# Altium project Phare.PrjPCB
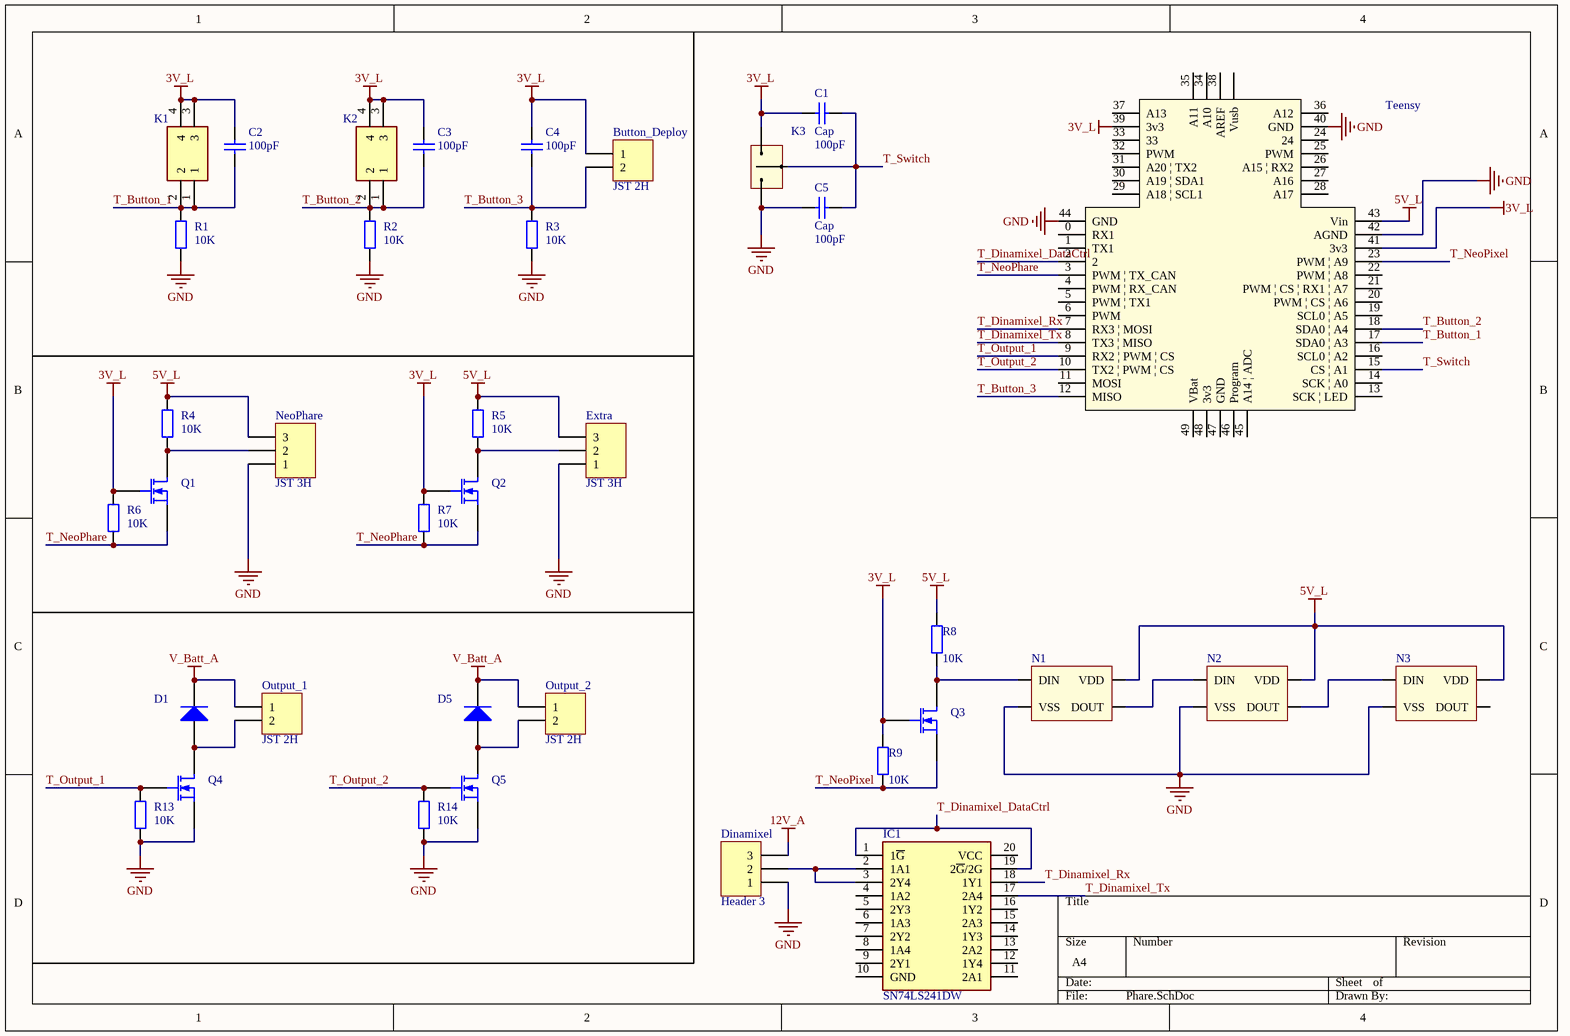
[diagram p0: Phare.SchDoc]
2 sheets, 58 parts. Net scope: global (net labels, ports and power ports of the same name join across sheets).
Board file: Phare.PcbDoc
Sheets:
  Phare.SchDoc
  Phare_Alim.SchDoc

## Sheet Phare.SchDoc
size A4

### Parts
Button_Deploy  JST 2H  [S2B-XH-A]
C1  Cap  value 100pF  [Capacitor 1206]
C2  value 100pF  [Capacitor 1206]  (hidden comment: Cap)
C3  value 100pF  [Capacitor 1206]  (hidden comment: Cap)
C4  value 100pF  [Capacitor 1206]  (hidden comment: Cap)
C5  Cap  value 100pF  [Capacitor 1206]
D1  Diode  [SMC]  (value not drawn)
D5  Diode  [SMC]  (value not drawn)
Dinamixel  Header 3  [Molex SPOX 3x1H]
Extra  JST 3H  [S3B-XH-A]
IC1  SN74LS241DW  [SOIC127P1030X265-20N]
K1  4-1437565-1  [FSM-SWITCH]  (value not drawn)
K2  4-1437565-1  [FSM-SWITCH]  (value not drawn)
K3  Switch  [SWITCH]  (value not drawn)
N1  NeoPixel  [Neopixel]  (value not drawn)
N2  NeoPixel  [Neopixel]  (value not drawn)
N3  NeoPixel  [Neopixel]  (value not drawn)
NeoPhare  JST 3H  [S3B-XH-A]
Output_1  JST 2H  [S2B-XH-A]
Output_2  JST 2H  [S2B-XH-A]
Q1  MOSFET-N  [SOT23_M]  (value not drawn)
Q2  MOSFET-N  [SOT23_M]  (value not drawn)
Q3  MOSFET-N  [SOT23_M]  (value not drawn)
Q4  MOSFET-N  [SOT23_M]  (value not drawn)
Q5  MOSFET-N  [SOT23_M]  (value not drawn)
R1  value 10K  [Resistor 1206]  (hidden comment: Res2)
R2  value 10K  [Resistor 1206]  (hidden comment: Res2)
R3  value 10K  [Resistor 1206]  (hidden comment: Res2)
R4  value 10K  [Resistor 1206]  (hidden comment: Res2)
R5  value 10K  [Resistor 1206]  (hidden comment: Res2)
R6  value 10K  [Resistor 1206]  (hidden comment: Res2)
R7  value 10K  [Resistor 1206]  (hidden comment: Res2)
R8  value 10K  [Resistor 1206]  (hidden comment: Res2)
R9  value 10K  [Resistor 1206]  (hidden comment: Res2)
R13  value 10K  [Resistor 1206]  (hidden comment: Res2)
R14  value 10K  [Resistor 1206]  (hidden comment: Res2)
Teensy  Teensy 3.2  [teensy]  (value not drawn)

### Nets
3V_L: Button_Deploy.1 C1.1 C2.1 C3.1 C4.1 K1.3 K1.4 K2.3 K2.4 K3.0(L) Q1.2(G) Q2.2(G) Q3.2(G) R6.1 R7.1 R9.1 Teensy.39(3v3) Teensy.41(3v3)
5V_L: Extra.3 N1.4(VDD) N2.4(VDD) N3.4(VDD) NeoPhare.3 R4.1 R5.1 R8.1 Teensy.43(Vin)
12V_A: Dinamixel.3
GND: C5.1 Dinamixel.1 Extra.1 K3.2(R) N1.2(VSS) N2.2(VSS) N3.2(VSS) NeoPhare.1 Q4.3(S) Q5.3(S) R1.2 R2.2 R3.2 R13.2 R14.2 Teensy.40(GND) Teensy.42(AGND) Teensy.44(GND)
V_Batt_A: D1.2(K) D5.2(K) Output_1.1 Output_2.1
T_Button_1: C2.2 K1.1 K1.2 R1.1 Teensy.17(SDA0_|_A3)
T_Button_2: C3.2 K2.1 K2.2 R2.1 Teensy.18(SDA0_|_A4)
T_Button_3: Button_Deploy.2 C4.2 R3.1 Teensy.12(MISO)
T_Dinamixel_DataCtrl: IC1.1(1~{G}) IC1.19(2~{G}/2G) Teensy.2
T_Dinamixel_Rx: IC1.18(1Y1) Teensy.7(RX3_|_MOSI)
T_Dinamixel_Tx: IC1.17(2A4) Teensy.8(TX3_|_MISO)
T_NeoPhare: Q1.3(S) Q2.3(S) R6.2 R7.2 Teensy.3(PWM_|_TX_CAN)
T_NeoPixel: Q3.3(S) R9.2 Teensy.23(PWM_|_A9)
T_Output_1: Q4.2(G) R13.1 Teensy.9(RX2_|_PWM_|_CS)
T_Output_2: Q5.2(G) R14.1 Teensy.10(TX2_|_PWM_|_CS)
T_Switch: C1.2 C5.2 K3.1(M) Teensy.15(CS_|_A1)
NetD1_1: D1.1(A) Output_1.2 Q4.1(D)
NetD5_1: D5.1(A) Output_2.2 Q5.1(D)
NetDinamixel_2: Dinamixel.2 IC1.2(1A1) IC1.3(2Y4)
NetExtra_2: Extra.2 Q2.1(D) R5.2
NetN1_1: N1.1(DOUT) N2.3(DIN)
NetN1_3: N1.3(DIN) Q3.1(D) R8.2
NetN2_1: N2.1(DOUT) N3.3(DIN)
NetNeoPhare_2: NeoPhare.2 Q1.1(D) R4.2

Not connected (* = marked no-connect by the designer): IC1 4(1A2) 5(2Y3) 6(1A3) 7(2Y2) 8(1A4) 9(2Y1) 10(GND) 11(2A1) 12(1Y4) 13(2A2) 14(1Y3) 15(2A3) 16(1Y2) 20(VCC); N3 1(DOUT); Teensy 0(RX1) 1(TX1) 4(PWM_|_RX_CAN) 5(PWM_|_TX1) 6(PWM) 11(MOSI) 13(SCK_|_LED) 14(SCK_|_A0) 16(SCL0_|_A2) 19(SCL0_|_A5) 20(PWM_|_CS_|_A6) 21(PWM_|_CS_|_RX1_|_A7) 22(PWM_|_A8) 24 25(PWM) 26(A15_|_RX2) 27(A16) 28(A17) 29(A18_|_SCL1) 30(A19_|_SDA1) 31(A20_|_TX2) 32(PWM) 33 34(A10) 35(A11) 36(A12) 37(A13) 38(AREF) 45(A14_|_ADC) 46(Program) 47(GND) 48(3v3) 49(VBat) 50(Vusb)

### Library data of the parts
Button_Deploy Output_1 Output_2 = Header 2: Header, 2-Pin; LatestRevisionDate: 17-Jul-2002; LatestRevisionNote: Re-released for DXP Platform.; Publisher: Altium Limited
C1-C5 = Cap: Capacitor; Published: 8-Jun-2000; LatestRevisionDate: 17-Jul-2002; LatestRevisionNote: Re-released for DXP Platform.; PackageReference: RAD-0.3; Publisher: Altium Limited; PackageDescription: Radial Cap, Thru-Hole; 2 Leads; 0.3 in Pin Spacing
D1 D5 = Diode: Default Diode; Published: 8-Jun-2000; LatestRevisionDate: 17-Jul-2002; LatestRevisionNote: Re-released for DXP Platform.; PackageVersion: Sep-1996; PackageReference: SMC; Publisher: Altium Limited; PackageDescription: DO-214-AB/SMC; 2 C-Bend Leads; Body 7.9 x 5.9 mm, inc. leads (LxW); Code_JEDEC: DO-214-AB
Dinamixel Extra NeoPhare = Header 3: Header, 3-Pin; LatestRevisionDate: 17-Jul-2002; LatestRevisionNote: Re-released for DXP Platform.; Publisher: Altium Limited
IC1 = SN74LS241DW: Integrated Circuit; Manufacturer_Name: Texas Instruments; Datasheet Link: http://www.ti.com/lit/gpn/SN74LS241; Height: 2.65mm; Manufacturer_Part_Number: SN74LS241DW; Arrow Part Number: SN74LS241DW; Arrow Price/Stock: https://www.arrow.com/en/products/sn74ls241dw/texas-instruments; Mouser Part Number: 595-SN74LS241DW; Mouser Price/Stock: https://www.mouser.co.uk/ProductDetail/Texas-Instruments/SN74LS241DW?qs=SL3LIuy2dWxYUNFhEYJjgw%3D%3D
K1 K2 = 4-1437565-1: Switch; Manufacturer_Name: TE Connectivity; Datasheet Link: http://docs-emea.rs-online.com/webdocs/14a3/0900766b814a3369.pdf; Manufacturer_Part_Number: 4-1437565-1; Arrow Part Number: 4-1437565-1; Arrow Price/Stock: https://www.arrow.com/en/products/4-1437565-1/te-connectivity; Mouser Part Number: N/A; Mouser Price/Stock: https://www.mouser.com/Search/Refine.aspx?Keyword=N%2FA
K3 = Switch: 3 pos switch, 09.03290.01
N1-N3 = NeoPixel: pin to pad: 1>2 2>3 3>4 4>1
Q1-Q5 = MOSFET-N: N-Channel MOSFET; pin to pad: 2>3 3>2; Published: 8-Jun-2000; LatestRevisionDate: 17-Jul-2002; LatestRevisionNote: Re-released for DXP Platform.; PackageVersion: 1995/1996; PackageReference: E3; Publisher: Altium Limited; PackageDescription: TO, Flat Index; 3 In-Line, Axial Leads; Body Dia. 4.6mm; Lead Dia. 0.5 mm (max)
R1-R9 R13 R14 = Res2: Resistor; Published: 8-Jun-2000; LatestRevisionDate: 17-Jul-2002; LatestRevisionNote: Re-released for DXP Platform.; PackageReference: AXIAL-0.4; Publisher: Altium Limited; PackageDescription: Axial Device, Thru-Hole; 2 Leads; 0.4 in Pin Spacing
Teensy = teensy3.2

## Sheet Phare_Alim.SchDoc
size A4
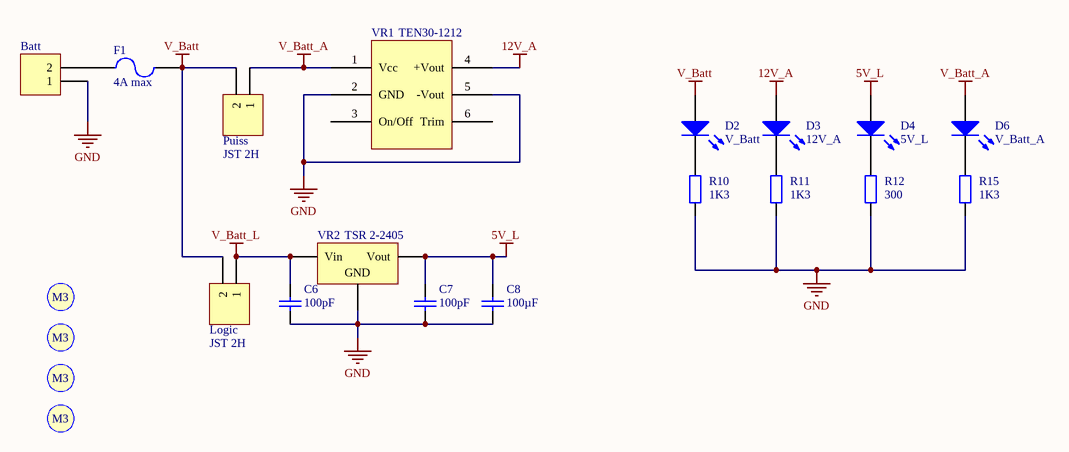
[diagram p1: Phare_Alim.SchDoc]

### Parts
Batt  (no value)  [Battery SALE]
C6  value 100pF  [Capacitor 1206]  (hidden comment: Cap)
C7  value 100pF  [Capacitor 1206]  (hidden comment: Cap)
C8  value 100µF  [Condensateur]  (hidden comment: Cap)
D2  V_Batt  [KP-3216SEC]
D3  12V_A  [KP-3216SEC]
D4  5V_L  [KP-3216SEC]
D6  V_Batt_A  [KP-3216SEC]
F1  4A max  [Fuse]
Logic  JST 2H  [S2B-XH-A]
Puiss  JST 2H  [Molex_MiniFitJr_2x1H]
R10  value 1K3  [Resistor 1206]  (hidden comment: Res2)
R11  value 1K3  [Resistor 1206]  (hidden comment: Res2)
R12  value 300  [Resistor 1206]  (hidden comment: Res2)
R15  value 1K3  [Resistor 1206]  (hidden comment: Res2)
S1  Screw M3  [Screw M3]  (value not drawn)
S2  Screw M3  [Screw M3]  (value not drawn)
S3  Screw M3  [Screw M3]  (value not drawn)
S4  Screw M3  [Screw M3]  (value not drawn)
VR1  TEN30-1212  [TRACO_2x1inch]
VR2  TSR 2-2405  [TRS]

### Nets
5V_L: C7.1 C8.1 D4.1(A) VR2.3(Vout)
12V_A: D3.1(A) VR1.4(+Vout)
GND: Batt.1 C6.2 C7.2 C8.2 R10.1 R11.1 R12.1 R15.1 VR1.2(GND) VR1.5(-Vout) VR2.2(GND)
V_Batt: D2.1(A) F1.2 Logic.2 Puiss.2
V_Batt_A: D6.1(A) Puiss.1 VR1.1(Vcc)
V_Batt_L: C6.1 Logic.1 VR2.1(Vin)
NetBatt_2: Batt.2 F1.1
NetD2_2: D2.2(K) R10.2
NetD3_2: D3.2(K) R11.2
NetD4_2: D4.2(K) R12.2
NetD6_2: D6.2(K) R15.2

Not connected (* = marked no-connect by the designer): VR1 3(On/Off) 6(Trim)

### Notes on the sheet
- (in symbol Screw M3) M3

### Library data of the parts
Batt Logic Puiss = Header 2: Header, 2-Pin; LatestRevisionDate: 17-Jul-2002; LatestRevisionNote: Re-released for DXP Platform.; Publisher: Altium Limited
C6-C8 = Cap: Capacitor; Published: 8-Jun-2000; LatestRevisionDate: 17-Jul-2002; LatestRevisionNote: Re-released for DXP Platform.; PackageReference: RAD-0.3; Publisher: Altium Limited; PackageDescription: Radial Cap, Thru-Hole; 2 Leads; 0.3 in Pin Spacing
D2-D4 D6 = LED2: Typical RED, GREEN, YELLOW, AMBER GaAs LED; Published: 8-Jun-2000; LatestRevisionDate: 17-Jul-2002; LatestRevisionNote: Re-released for DXP Platform.; PackageVersion: Feb-2002; PackageReference: 3.2X1.6X1.1; Publisher: Altium Limited; PackageDescription: SM LED; 2 Flat Leads
F1 = Fuse 2: Fuse; Published: 8-Jun-2000; LatestRevisionDate: 17-Jul-2002; LatestRevisionNote: Re-released for DXP Platform.; PackageReference: PIN-W2/E2.8; Publisher: Altium Limited; PackageDescription: Thru-Hole; 2 Leads
R10-R12 R15 = Res2: Resistor; Published: 8-Jun-2000; LatestRevisionDate: 17-Jul-2002; LatestRevisionNote: Re-released for DXP Platform.; PackageReference: AXIAL-0.4; Publisher: Altium Limited; PackageDescription: Axial Device, Thru-Hole; 2 Leads; 0.4 in Pin Spacing
VR1 = TEN50: TRACO TEN50; LatestRevisionDate: 17-Jul-2002; LatestRevisionNote: Re-released for DXP Platform.; Publisher: Altium Limited
VR2 = Volt Reg: Voltage Regulator; Published: 24-Mar-1999; LatestRevisionDate: 29-May-2009; LatestRevisionNote: IPC-7351 Footprint Added.; PackageReference: D2PAK; Publisher: Altium Limited; PackageDescription: 3-Pin Transistor Outline Package 2.54 mm Pitch, 15.1 mm Lead Span

## Nets that join several sheets
5V_L: Phare (9 pins), Phare_Alim (C7.1 C8.1 D4.1 VR2.3)
12V_A: Phare (Dinamixel.3), Phare_Alim (D3.1 VR1.4)
GND: Phare (18 pins), Phare_Alim (11 pins)
V_Batt_A: Phare (D1.2 D5.2 Output_1.1 Output_2.1), Phare_Alim (D6.1 Puiss.1 VR1.1)